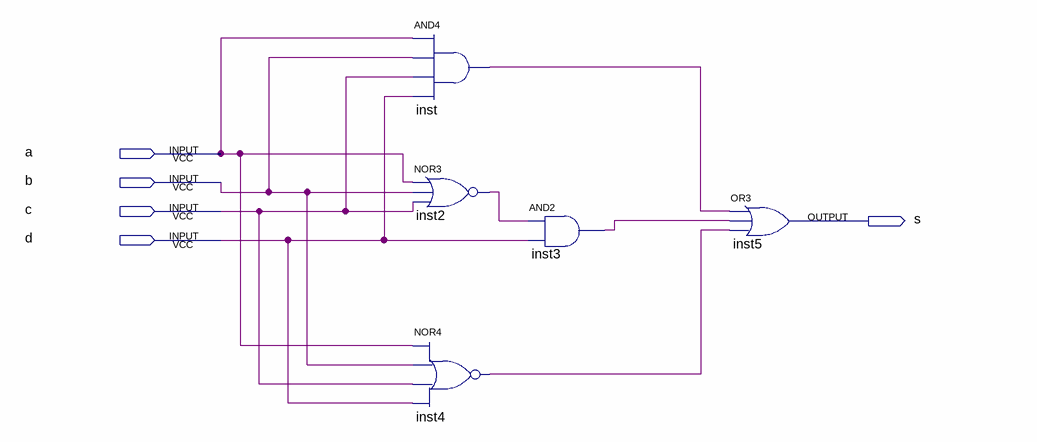
[diagram p0: schematic sheet]
// Quartus schematic QUEST_2_3.bdf as structural Verilog: 5 symbols, 5 pins
module QUEST_2_3 (
  input  a,
  input  b,
  input  c,
  input  d,
  output s
);

  wire inst2_out, inst3_out, inst4_out, inst_out;

  and inst (inst_out, a, b, c, d);
  nor inst2 (inst2_out, a, b, c);
  nor inst4 (inst4_out, a, b, c, d);
  and inst3 (inst3_out, inst2_out, d);
  or inst5 (s, inst_out, inst3_out, inst4_out);
endmodule
